# Altium schematic sheet AFPGA_FMC1_bank0.SchDoc: AFGA FMC1
size 420 x 297 mm; CheckedBy: T.Janicki; CompanyName: Creotech Instruments SA; DrawnBy: G.Kasprowicz; Organization: CERN; Address1: European Organization for Nuclear Research; Address2: CH-1211 Genève 23 - Switzerland; Revision: -; SheetNumber: 5; SheetTotal: 19; EDA_Number: EDA-xxxx; Projet: Simple VME FMC Carrier; ModifiedBy: -; CreateDate: 20/11/2012; CheckedDate: 23/01/2012; Title2: - bank 0 -; DivGrp: BE-CO; Designer: G.Kasprowicz; PageSetup: Record=PageOptions|CenterHorizontal=True|CenterVertical=True|PrintScale=0.95|XCorrection=1.00|YCorrection=1.00|PrintKind=1|BorderSize=5000000|LeftOffset=0|BottomOffset=0|Orientation=2|PaperLength=1000|PaperWidth=1000|Scale=100|PaperSource=15|PrintQuality=600|MediaType=1|DitherType=10|PaperKind=A3|PrintScaleMode=1; ModifiedDate: -
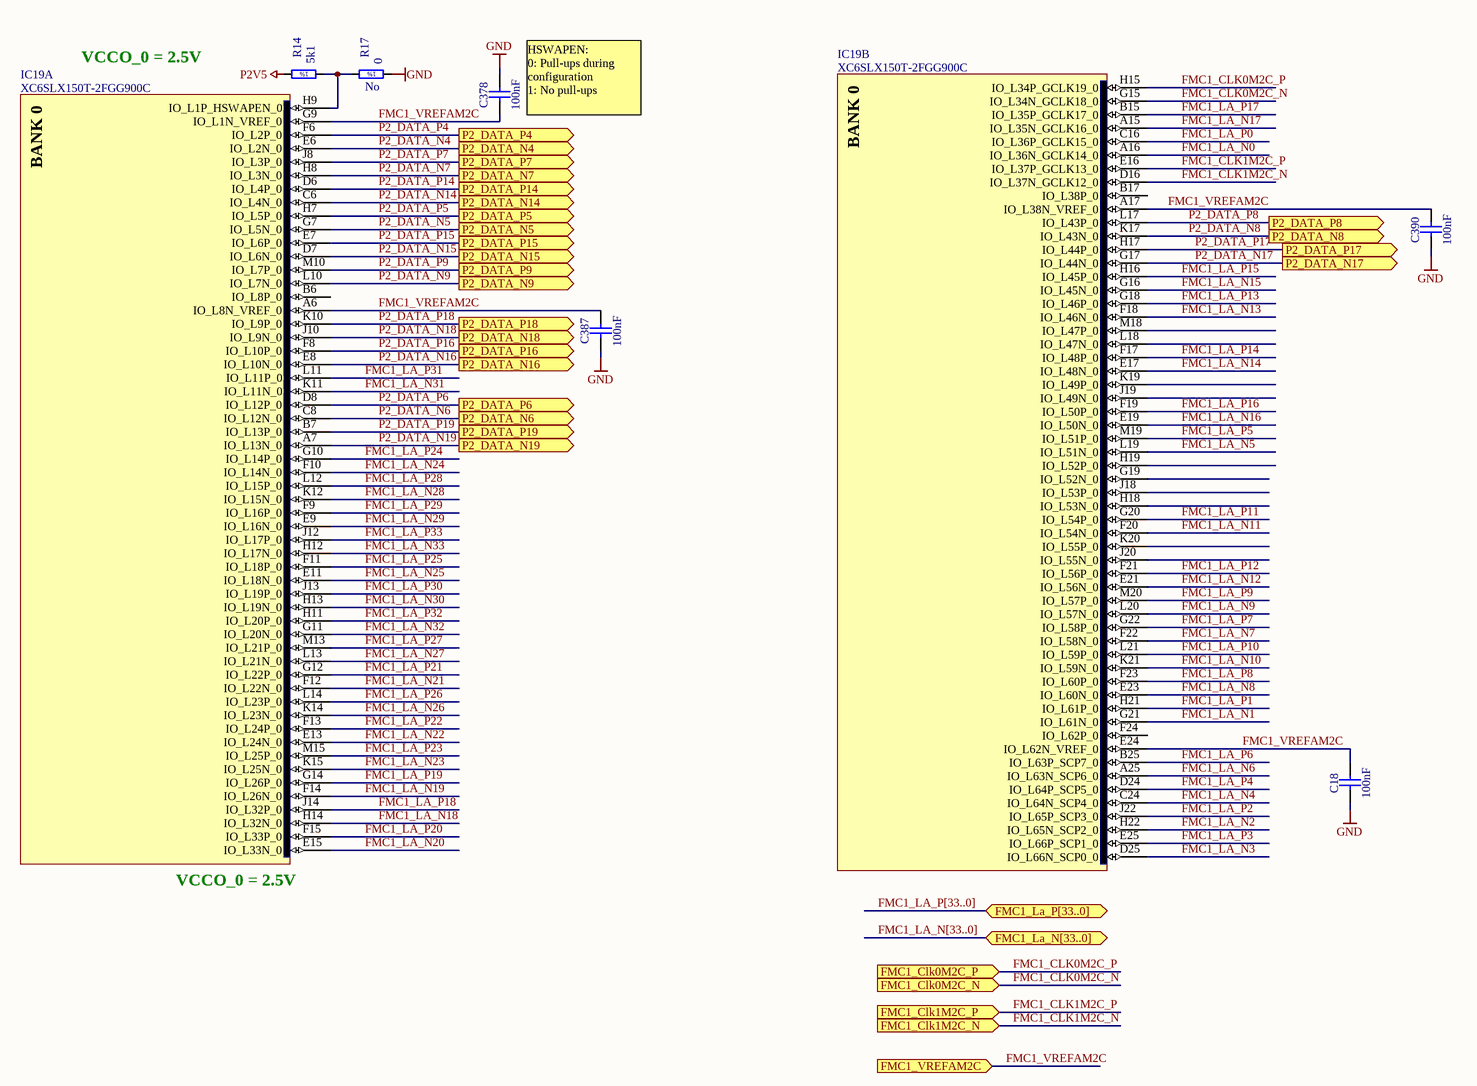
[diagram p0: AFPGA_FMC1_bank0.SchDoc]

## Parts
C18  100nF  [CAPC1005X55N]
C378  100nF  [CAPC1005X55N]
C387  100nF  [CAPC1005X55N]
C390  100nF  [CAPC1005X55N]
IC19  XC6SLX150T-2FGG900C  [BGA900C100P30X30_3100X3100X260]  (parts A,B of 18)
R14  5k1  [RESC1608X55N]
R17  0  Mounted: No  [RESC1608X55N]

## Ports
FMC1_Clk0M2C_N (in), FMC1_Clk0M2C_P (in), FMC1_Clk1M2C_N (in), FMC1_Clk1M2C_P (in), FMC1_La_N[33..0] (bidir), FMC1_La_P[33..0] (bidir), FMC1_VREFAM2C (in), P2_DATA_N4 (out), P2_DATA_N5 (out), P2_DATA_N6 (out), P2_DATA_N7 (out), P2_DATA_N8 (out), P2_DATA_N9 (out), P2_DATA_N14 (out), P2_DATA_N15 (out), P2_DATA_N16 (out), P2_DATA_N17 (out), P2_DATA_N18 (out), P2_DATA_N19 (out), P2_DATA_P4 (out), P2_DATA_P5 (out), P2_DATA_P6 (out), P2_DATA_P7 (out), P2_DATA_P8 (out), P2_DATA_P9 (out), P2_DATA_P14 (out), P2_DATA_P15 (out), P2_DATA_P16 (out), P2_DATA_P17 (out), P2_DATA_P18 (out), P2_DATA_P19 (out)

## Nets
GND: C18.1 C378.2 C387.1 C390.1 R17.1
P2V5: R14.2
FMC1_CLK0M2C_N: IC19.G15(IO_L34N_GCLK18_0) ; port FMC1_Clk0M2C_N
FMC1_CLK0M2C_P: IC19.H15(IO_L34P_GCLK19_0) ; port FMC1_Clk0M2C_P
FMC1_CLK1M2C_N: IC19.D16(IO_L37N_GCLK12_0) ; port FMC1_Clk1M2C_N
FMC1_CLK1M2C_P: IC19.E16(IO_L37P_GCLK13_0) ; port FMC1_Clk1M2C_P
FMC1_LA_N0: IC19.A16(IO_L36N_GCLK14_0)
FMC1_LA_N1: IC19.G21(IO_L61N_0)
FMC1_LA_N2: IC19.H22(IO_L65N_SCP2_0)
FMC1_LA_N3: IC19.D25(IO_L66N_SCP0_0)
FMC1_LA_N4: IC19.C24(IO_L64N_SCP4_0)
FMC1_LA_N5: IC19.L19(IO_L51N_0)
FMC1_LA_N6: IC19.A25(IO_L63N_SCP6_0)
FMC1_LA_N7: IC19.F22(IO_L58N_0)
FMC1_LA_N8: IC19.E23(IO_L60N_0)
FMC1_LA_N9: IC19.L20(IO_L57N_0)
FMC1_LA_N10: IC19.K21(IO_L59N_0)
FMC1_LA_N11: IC19.F20(IO_L54N_0)
FMC1_LA_N12: IC19.E21(IO_L56N_0)
FMC1_LA_N13: IC19.F18(IO_L46N_0)
FMC1_LA_N14: IC19.E17(IO_L48N_0)
FMC1_LA_N15: IC19.G16(IO_L45N_0)
FMC1_LA_N16: IC19.E19(IO_L50N_0)
FMC1_LA_N17: IC19.A15(IO_L35N_GCLK16_0)
FMC1_LA_N18: IC19.H14(IO_L32N_0)
FMC1_LA_N19: IC19.F14(IO_L26N_0)
FMC1_LA_N20: IC19.E15(IO_L33N_0)
FMC1_LA_N21: IC19.F12(IO_L22N_0)
FMC1_LA_N22: IC19.E13(IO_L24N_0)
FMC1_LA_N23: IC19.K15(IO_L25N_0)
FMC1_LA_N24: IC19.F10(IO_L14N_0)
FMC1_LA_N25: IC19.E11(IO_L18N_0)
FMC1_LA_N26: IC19.K14(IO_L23N_0)
FMC1_LA_N27: IC19.L13(IO_L21N_0)
FMC1_LA_N28: IC19.K12(IO_L15N_0)
FMC1_LA_N29: IC19.E9(IO_L16N_0)
FMC1_LA_N30: IC19.H13(IO_L19N_0)
FMC1_LA_N31: IC19.K11(IO_L11N_0)
FMC1_LA_N32: IC19.G11(IO_L20N_0)
FMC1_LA_N33: IC19.H12(IO_L17N_0)
FMC1_LA_P0: IC19.C16(IO_L36P_GCLK15_0)
FMC1_LA_P1: IC19.H21(IO_L61P_0)
FMC1_LA_P2: IC19.J22(IO_L65P_SCP3_0)
FMC1_LA_P3: IC19.E25(IO_L66P_SCP1_0)
FMC1_LA_P4: IC19.D24(IO_L64P_SCP5_0)
FMC1_LA_P5: IC19.M19(IO_L51P_0)
FMC1_LA_P6: IC19.B25(IO_L63P_SCP7_0)
FMC1_LA_P7: IC19.G22(IO_L58P_0)
FMC1_LA_P8: IC19.F23(IO_L60P_0)
FMC1_LA_P9: IC19.M20(IO_L57P_0)
FMC1_LA_P10: IC19.L21(IO_L59P_0)
FMC1_LA_P11: IC19.G20(IO_L54P_0)
FMC1_LA_P12: IC19.F21(IO_L56P_0)
FMC1_LA_P13: IC19.G18(IO_L46P_0)
FMC1_LA_P14: IC19.F17(IO_L48P_0)
FMC1_LA_P15: IC19.H16(IO_L45P_0)
FMC1_LA_P16: IC19.F19(IO_L50P_0)
FMC1_LA_P17: IC19.B15(IO_L35P_GCLK17_0)
FMC1_LA_P18: IC19.J14(IO_L32P_0)
FMC1_LA_P19: IC19.G14(IO_L26P_0)
FMC1_LA_P20: IC19.F15(IO_L33P_0)
FMC1_LA_P21: IC19.G12(IO_L22P_0)
FMC1_LA_P22: IC19.F13(IO_L24P_0)
FMC1_LA_P23: IC19.M15(IO_L25P_0)
FMC1_LA_P24: IC19.G10(IO_L14P_0)
FMC1_LA_P25: IC19.F11(IO_L18P_0)
FMC1_LA_P26: IC19.L14(IO_L23P_0)
FMC1_LA_P27: IC19.M13(IO_L21P_0)
FMC1_LA_P28: IC19.L12(IO_L15P_0)
FMC1_LA_P29: IC19.F9(IO_L16P_0)
FMC1_LA_P30: IC19.J13(IO_L19P_0)
FMC1_LA_P31: IC19.L11(IO_L11P_0)
FMC1_LA_P32: IC19.H11(IO_L20P_0)
FMC1_LA_P33: IC19.J12(IO_L17P_0)
FMC1_VREFAM2C: C18.2 C378.1 C387.2 C390.2 IC19.A6(IO_L8N_VREF_0) IC19.A17(IO_L38N_VREF_0) IC19.E24(IO_L62N_VREF_0) IC19.G9(IO_L1N_VREF_0) ; port FMC1_VREFAM2C
P2_DATA_N4: IC19.E6(IO_L2N_0) ; port P2_DATA_N4
P2_DATA_N5: IC19.G7(IO_L5N_0) ; port P2_DATA_N5
P2_DATA_N6: IC19.C8(IO_L12N_0) ; port P2_DATA_N6
P2_DATA_N7: IC19.H8(IO_L3N_0) ; port P2_DATA_N7
P2_DATA_N8: IC19.K17(IO_L43N_0) ; port P2_DATA_N8
P2_DATA_N9: IC19.L10(IO_L7N_0) ; port P2_DATA_N9
P2_DATA_N14: IC19.C6(IO_L4N_0) ; port P2_DATA_N14
P2_DATA_N15: IC19.D7(IO_L6N_0) ; port P2_DATA_N15
P2_DATA_N16: IC19.E8(IO_L10N_0) ; port P2_DATA_N16
P2_DATA_N17: IC19.G17(IO_L44N_0) ; port P2_DATA_N17
P2_DATA_N18: IC19.J10(IO_L9N_0) ; port P2_DATA_N18
P2_DATA_N19: IC19.A7(IO_L13N_0) ; port P2_DATA_N19
P2_DATA_P4: IC19.F6(IO_L2P_0) ; port P2_DATA_P4
P2_DATA_P5: IC19.H7(IO_L5P_0) ; port P2_DATA_P5
P2_DATA_P6: IC19.D8(IO_L12P_0) ; port P2_DATA_P6
P2_DATA_P7: IC19.J8(IO_L3P_0) ; port P2_DATA_P7
P2_DATA_P8: IC19.L17(IO_L43P_0) ; port P2_DATA_P8
P2_DATA_P9: IC19.M10(IO_L7P_0) ; port P2_DATA_P9
P2_DATA_P14: IC19.D6(IO_L4P_0) ; port P2_DATA_P14
P2_DATA_P15: IC19.E7(IO_L6P_0) ; port P2_DATA_P15
P2_DATA_P16: IC19.F8(IO_L10P_0) ; port P2_DATA_P16
P2_DATA_P17: IC19.H17(IO_L44P_0) ; port P2_DATA_P17
P2_DATA_P18: IC19.K10(IO_L9P_0) ; port P2_DATA_P18
P2_DATA_P19: IC19.B7(IO_L13P_0) ; port P2_DATA_P19
NetIC19_H9: IC19.H9(IO_L1P_HSWAPEN_0) R14.1 R17.2

Not connected (* = marked no-connect by the designer): IC19 B6(IO_L8P_0) B17(IO_L38P_0) F24(IO_L62P_0) G19(IO_L52N_0) H18(IO_L53N_0) H19(IO_L52P_0) J18(IO_L53P_0) J19(IO_L49N_0) J20(IO_L55N_0) K19(IO_L49P_0) K20(IO_L55P_0) L18(IO_L47N_0) M18(IO_L47P_0)

## Buses and harness runs
bus FMC1_LA_N[33..0] = port FMC1_La_N[33..0]
bus FMC1_LA_P[33..0] = port FMC1_La_P[33..0]

## Notes on the sheet
- VCCO_0 = 2.5V
- (near C378) HSWAPEN:
  0: Pull-ups during configuration
  1: No pull-ups
- (near IC19) VCCO_0 = 2.5V
- Project/Equipment
- Document
- Designer
- Drawn by
- Check.by
- File
- Last Mod.
- Print Date
- Sheet
- Size
- A3
- of
- Rev
- (in symbol R0603_0R_JUMPER) 1%
- (in symbol R0603_5K1_1%_0.1W_100PPM) 1%
- (in symbol XC6SLX150T-2FGG900C, part A) BANK 0
- (in symbol XC6SLX150T-2FGG900C, part B) BANK 0

## Library data of the parts
C18 C378 C387 C390 = CC0402_100NF_16V_10%_X7R: Non-polarised capacitor; Part Description: SMD Multilayer Chip Ceramic Capacitor; Manufacturer: GENERIC; Manufacturer1 Part Number: 223878715649; Voltage: 16V; TC: X7R; Tolerance: ±10%; Table: Capacitors SMD; Part Number: CC0402_100NF_16V_10%_X7R; Component Kind: Standard; Component Type: Standard; Pin Count: 2; Value: 100nF; Status: Not Recommended; Manufacturer Part Number: CC0402_100NF_16V_10%_X7R; Case: 0402; Mounted: Yes; Socket: No; SMD: Yes; Manufacturer1 Example: PHYCOMP; Manufacturer1 ComponentHeight: 0.55mm; HelpURL: \\cern.ch\dfs\Applications\Altium\Datasheets\CC0402_X7R_PHYCOMP.pdf; Author: CERN DEM JLC; CreateDate: 03/12/2007; LatestRevisionDate: 03/12/2007
IC19 = XC6SLX150T-2FGG900C: SPARTAN-6, FPGA, 900-Ball BGA, Commercial Grade, Pb-Free; Part Description: SPARTAN-6, FPGA, 540 User I/Os, 8 GTPs, 900-Ball BGA, Commercial Grade, Pb-Free; Manufacturer: XILINX; Table: Logic; Part Number: XC6SLX150T-2FGG900C; Component Kind: Standard; Component Type: Standard; Device: XC6SLX150T-2FGG900C; PackageDescription: BGA,1.00mm pitch, square; 900 pin, 30 columns X 30 rows, 31.00mm X 31.00mm X 2.60mm H, IPC Medium Density; Manufacturer Part Number: XC6SLX150T-2FGG900C; Pin Count: 900; Case: BGA900; Mounted: Yes; Socket: No; SMD: Yes; ComponentHeight: 2.6mm; HelpURL: \\cern.ch\dfs\Applications\Altium\Datasheets\XC6SLX150T-2FGG900C.pdf; ComponentLink1URL: \\cern.ch\dfs\Applications\Altium\Datasheets\XC6SLX150T-2FGG900C_Package-Pinouts.pdf; ComponentLink1Description: Package/Pinouts; Author: CERN DEM JLC; CreateDate: 2009-11-17; LatestRevisionDate: 2009-11-17
R14 = R0603_5K1_1%_0.1W_100PPM: Resistor - 1%; Part Description: General Purpose Thick Film Chip Resistor; Manufacturer: GENERIC; Manufacturer1 Part Number: NRC06F5101TRF; Power: 0.1W; TC: ±100ppm/°C; Table: Resistors SMD; Part Number: R0603_5K1_1%_0.1W_100PPM; Component Kind: Standard; Component Type: Standard; Pin Count: 2; Value: 5k1; Status: Preferred; Tolerance: ±1%; Manufacturer Part Number: R0603_5K1_1%_0.1W_100PPM; Case: 0603; Mounted: Yes; Socket: No; SMD: Yes; Manufacturer1 Example: NIC COMPONENT; Manufacturer1 ComponentHeight: 0.55mm; HelpURL: \\cern.ch\dfs\Applications\Altium\Datasheets\R0603_NIC_NRC.pdf; Author: CERN DEM JLC; CreateDate: 03/12/2007; LatestRevisionDate: 13/03/2008
R17 = R0603_0R_JUMPER: Resistor - 1%; Part Description: 1A (0.05R Max DC Resistance) Zero Ohm Jumper; Manufacturer: GENERIC; Manufacturer1 Part Number: NRC06Z0; Table: Resistors SMD; Part Number: R0603_0R_JUMPER; Component Kind: Standard; Component Type: Standard; Pin Count: 2; Value: 0; Status: Preferred; Manufacturer Part Number: R0603_0R_JUMPER; Case: 0603; Socket: No; SMD: Yes; Manufacturer1 Example: NIC COMPONENT; Manufacturer1 ComponentHeight: 0.55mm; HelpURL: \\cern.ch\dfs\Applications\Altium\Datasheets\R0603_NIC_NRC.pdf; Author: CERN DEM JLC; CreateDate: 12/3/2007; LatestRevisionDate: 3/13/2008